# Altium schematic sheet SpeakEasy_Audio.SchDoc
size A
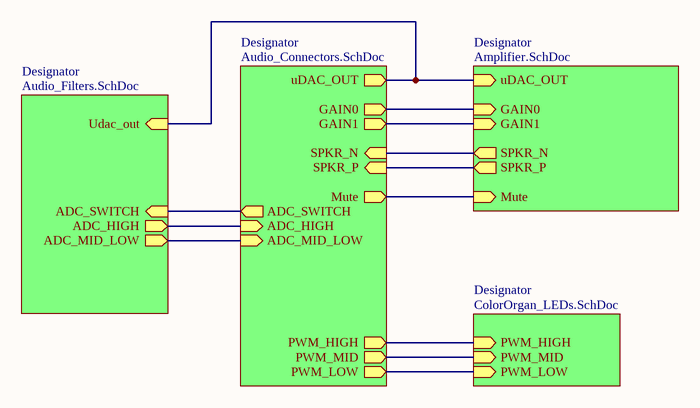
[diagram p0: SpeakEasy_Audio.SchDoc]

## Sub-sheets
Designator = Audio_Connectors.SchDoc: uDAC_OUT (out), SPKR_N (in), SPKR_P (in), PWM_LOW (out), PWM_HIGH (out), PWM_MID (out), GAIN1 (out), GAIN0 (out), Mute (out), ADC_SWITCH (out), ADC_HIGH (in), ADC_MID_LOW (in)
Designator = Amplifier.SchDoc: SPKR_P (out), uDAC_OUT (in), SPKR_N (out), GAIN0 (in), GAIN1 (in), Mute (in)
Designator = ColorOrgan_LEDs.SchDoc: PWM_MID (in), PWM_LOW (in), PWM_HIGH (in)
Designator = Audio_Filters.SchDoc: Udac_out (in), ADC_SWITCH (in), ADC_HIGH (out), ADC_MID_LOW (out)

## Nets
(unnamed): sheet Designator/uDAC_OUT, sheet Designator/uDAC_OUT, sheet Designator/Udac_out
(unnamed): sheet Designator/SPKR_N, sheet Designator/SPKR_N
(unnamed): sheet Designator/SPKR_P, sheet Designator/SPKR_P
(unnamed): sheet Designator/PWM_LOW, sheet Designator/PWM_LOW
(unnamed): sheet Designator/PWM_HIGH, sheet Designator/PWM_HIGH
(unnamed): sheet Designator/PWM_MID, sheet Designator/PWM_MID
(unnamed): sheet Designator/GAIN1, sheet Designator/GAIN1
(unnamed): sheet Designator/GAIN0, sheet Designator/GAIN0
(unnamed): sheet Designator/Mute, sheet Designator/Mute
(unnamed): sheet Designator/ADC_SWITCH, sheet Designator/ADC_SWITCH
(unnamed): sheet Designator/ADC_HIGH, sheet Designator/ADC_HIGH
(unnamed): sheet Designator/ADC_MID_LOW, sheet Designator/ADC_MID_LOW